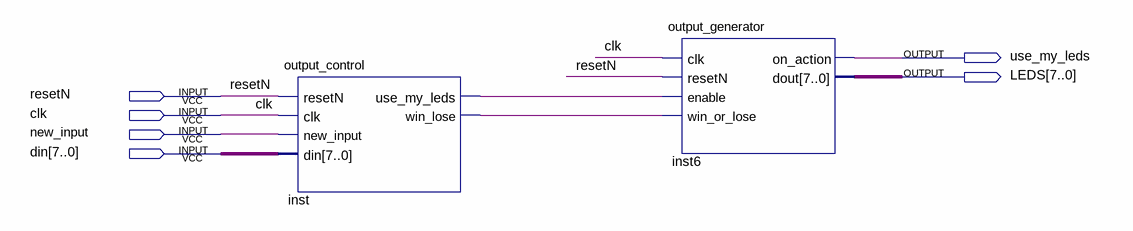
[diagram p0: schematic sheet]
// Quartus schematic control_leds.bdf as structural Verilog: 2 symbols, 6 pins
module control_leds (
  input  resetN,
  input  clk,
  input  new_input,
  input  [7:0] din,
  output use_my_leds,
  output [7:0] LEDS
);

  wire inst_use_my_leds, inst_win_lose;

  output_control inst (
    .resetN(resetN), .clk(clk), .new_input(new_input), .din(din), .use_my_leds(inst_use_my_leds),
    .win_lose(inst_win_lose));
  output_generator inst6 (
    .clk(clk), .resetN(resetN), .enable(inst_use_my_leds), .win_or_lose(inst_win_lose),
    .on_action(use_my_leds), .dout(LEDS));
endmodule
